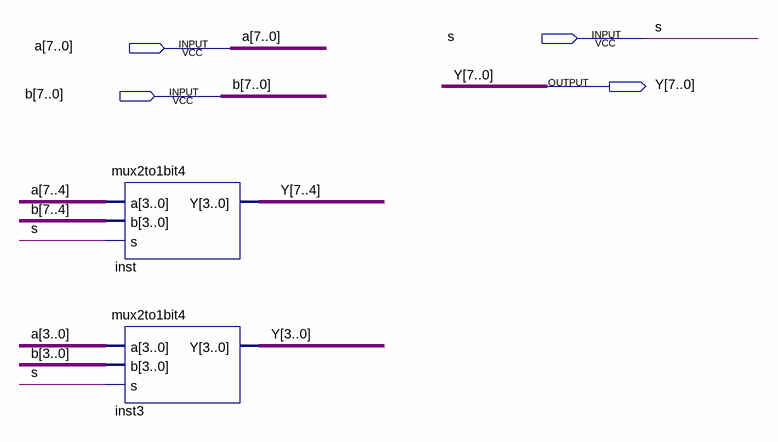
[diagram p0: schematic sheet]
// Quartus schematic mux2to1bit8.bdf as structural Verilog: 2 symbols, 4 pins
module mux2to1bit8 (
  input  s,
  input  [7:0] a,
  input  [7:0] b,
  output [7:0] Y
);

  mux2to1bit4 inst (.a(a[7:4]), .b(b[7:4]), .s(s), .Y(Y[7:4]));
  mux2to1bit4 inst3 (.a(a[3:0]), .b(b[3:0]), .s(s), .Y(Y[3:0]));
endmodule
